# EAGLE schematic train cont R4 (EAGLE 8.1.1)
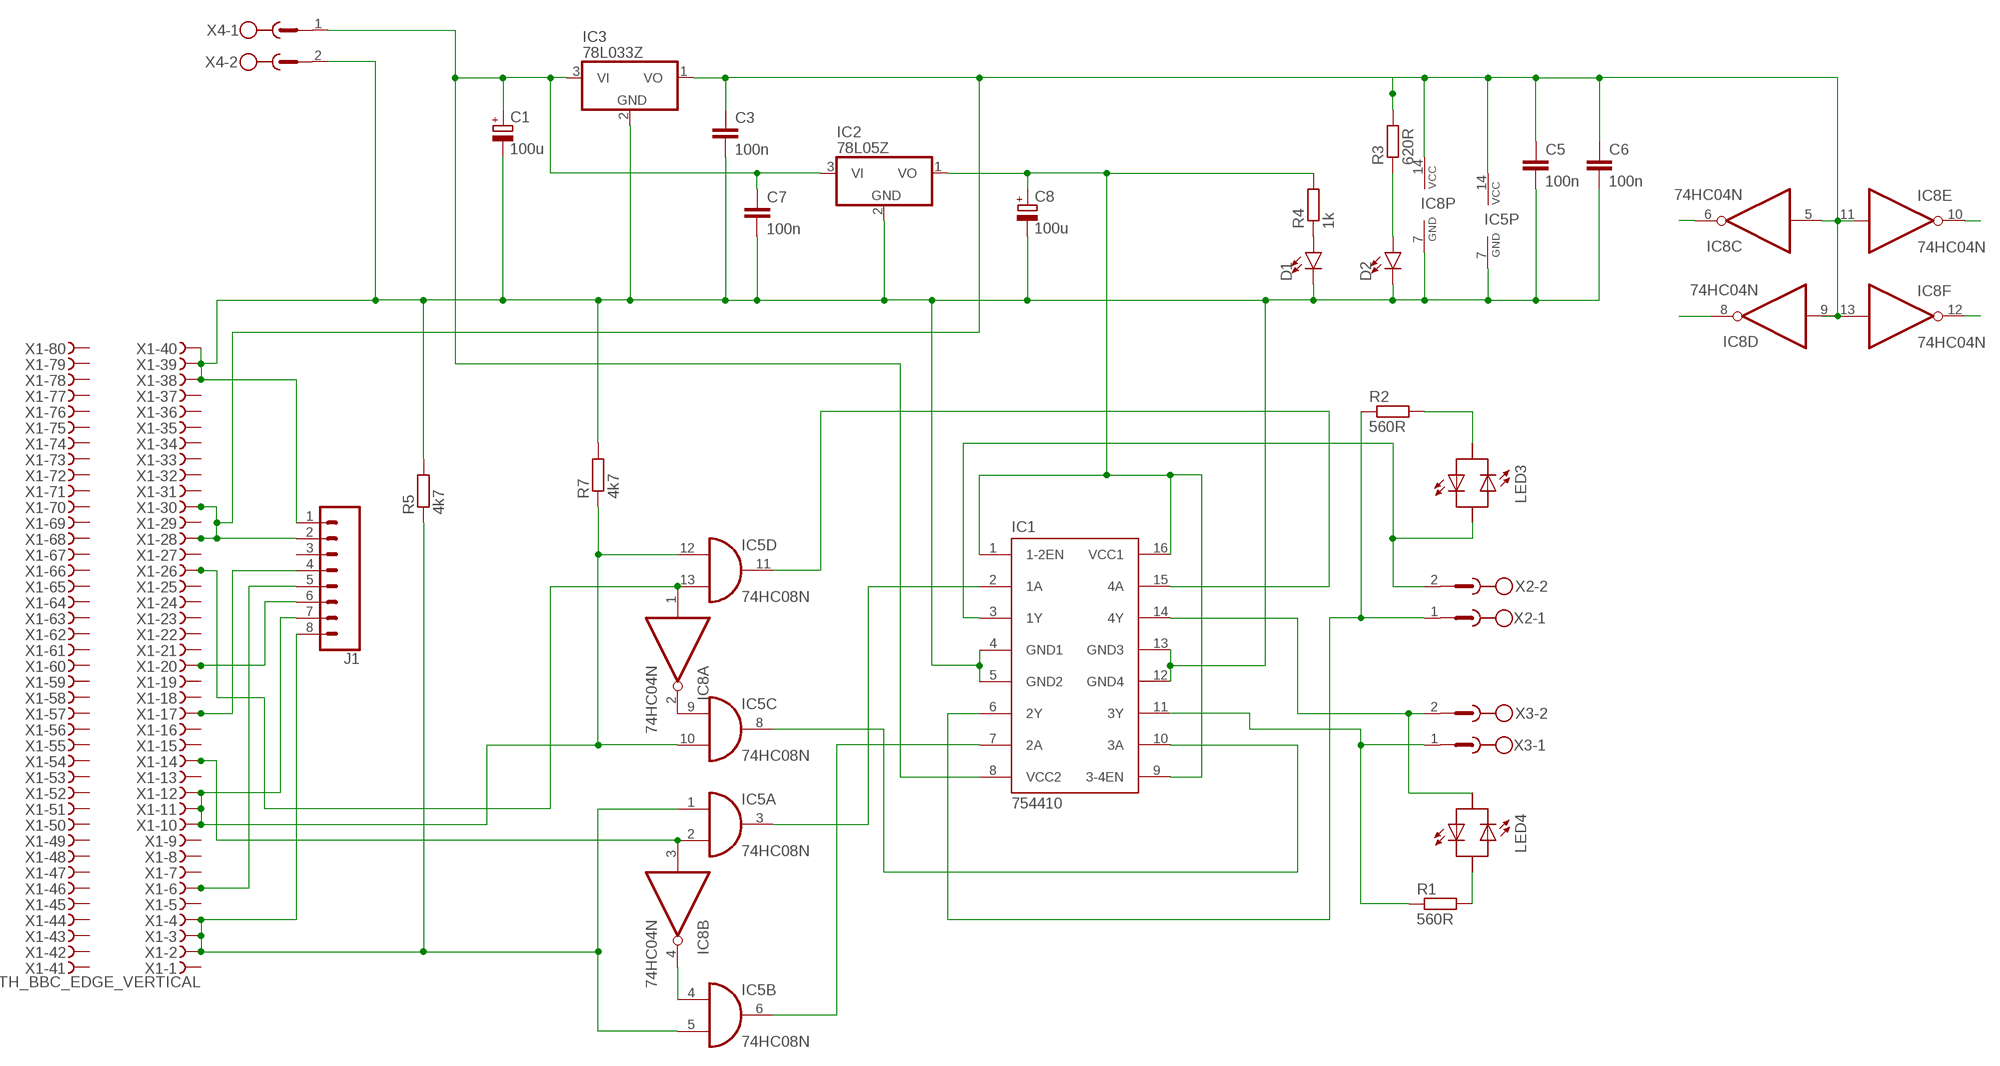
[diagram p0: schematic, sheet 1]

## Parts
C1  100u  CPOL-EUE2,5-6E  [E2,5-6E]
C3  100n  C-EU050-025X075  [C050-025X075]
C5  100n  C-EU050-025X075  [C050-025X075]
C6  100n  C-EU050-025X075  [C050-025X075]
C7  100n  C-EU050-025X075  [C050-025X075]
C8  100u  CPOL-EUE2,5-6E  [E2,5-6E]
D1  LED3MM  [LED_3MM]
D2  LED3MM  [LED_3MM]
IC1  754410  L293E  [DIL16]
IC2  78L05Z  [TO92]
IC3  78L033Z  78L05Z  [TO92]
IC5  74HC08N  [DIL14]
IC8  74HC04N  74AC04N  [DIL14]
J1  CONN_08"  [1X08]
LED3  LED_LED5MM  [LED_LED5MM]
LED4  LED_LED5MM  [LED_LED5MM]
R1  560R  R-EU_0207/10  [0207/10]
R2  560R  R-EU_0207/10  [0207/10]
R3  620R  R-EU_0207/10  [0207/10]
R4  1k  R-EU_0207/10  [0207/10]
R5  4k7  R-EU_0207/15  [0207/15]
R7  4k7  R-EU_0207/10  [0207/10]
X1  PTH_BBC_EDGE_VERTICAL  [PTH_BBC_EDGE]
X2  MSTBV2  [MSTBV2]
X3  MSTBV2  [MSTBV2]
X4  MSTBV2  [MSTBV2]

## Nets
N$1: LED4.K(C) R1.2
N$2: C3.1 C5.1 C6.1 IC3.1(VO) IC5.14(P:VCC) IC8.5(C:I) IC8.9(D:I) IC8.11(E:I) IC8.13(F:I) IC8.14(P:VCC) J1.2 R3.2 X1.28 X1.30
N$3: IC5.4(B:I0) IC8.4(B:O)
N$4: D2.A R3.1
N$5: IC1.2(1A) IC5.3(A:O)
N$6: IC8.12(F:O)
N$7: C8.+ IC1.1(1-2EN) IC1.9(3-4EN) IC1.16(VCC1) IC2.1(VO) R4.2
N$8: C1.+ C7.1 IC1.8(VCC2) IC2.3(VI) IC3.3(VI) X4.1
N$9: IC5.9(C:I0) IC8.2(A:O)
N$10: IC1.7(2A) IC5.6(B:O)
N$12: IC5.1(A:I0) IC5.5(B:I1) J1.8 R5.1 X1.2 X1.3 X1.4
N$13: IC5.2(A:I1) IC8.3(B:I) X1.14
N$14: IC1.15(4A) IC5.11(D:O)
N$15: IC1.10(3A) IC5.8(C:O)
N$16: IC1.3(1Y) LED3.K(C) X2.2
N$17: IC1.6(2Y) R2.1 X2.1
N$18: IC1.14(4Y) LED4.A X3.2
N$19: IC1.11(3Y) R1.1 X3.1
N$21: LED3.A R2.2
N$22: D1.A R4.1
N$23: C1.- C3.2 C5.2 C6.2 C7.2 C8.- D1.K(C) D2.K(C) IC1.4(GND1) IC1.5(GND2) IC1.12(GND4) IC1.13(GND3) IC2.2(GND) IC3.2(GND) IC5.7(P:GND) IC8.7(P:GND) J1.1 R5.2 R7.2 X1.38 X1.39 X1.40 X4.2
N$25: IC8.8(D:O)
N$26: IC8.10(E:O)
N$27: IC8.6(C:O)
N$28: IC5.10(C:I1) IC5.12(D:I0) J1.7 R7.1 X1.10 X1.11 X1.12
N$29: J1.6 X1.20
N$31: J1.5 X1.6
N$32: J1.4 X1.17
N$37: IC5.13(D:I1) IC8.1(A:I) X1.26
Unconnected: J1.3 X1.1 X1.5 X1.7 X1.8 X1.9 X1.13 X1.15 X1.16 X1.18 X1.19 X1.21 X1.22 X1.23 X1.24 X1.25 X1.27 X1.29 X1.31 X1.32 X1.33 X1.34 X1.35 X1.36 X1.37 X1.41 X1.42 X1.43 X1.44 X1.45 X1.46 X1.47 X1.48 X1.49 X1.50 X1.51 X1.52 X1.53 X1.54 X1.55 X1.56 X1.57 X1.58 X1.59 X1.60 X1.61 X1.62 X1.63 X1.64 X1.65 X1.66 X1.67 X1.68 X1.69 X1.70 X1.71 X1.72 X1.73 X1.74 X1.75 X1.76 X1.77 X1.78 X1.79 X1.80

## Library data of the parts
C1 C8 = resistor:CPOL-EU: POLARIZED CAPACITOR, European symbol
C3 C5-C7 = resistor:C-EU: CAPACITOR, European symbol
D1 D2 = SparkFun-LED:LED: LED (Generic) Standard schematic elements and footprints for 5mm, 3mm, 1206, and 0603 sized LEDs. Generic LEDs with no color specified.; PROD_ID: DIO-08794
IC1 = texas:L293E: TI DEVICE; MF: Arrow Electronics; MPN: L293E; OC_FARNELL: 1467711; OC_NEWARK: 89K0732
IC2 IC3 = linear:78*: Positive VOLTAGE REGULATOR Source: http://cache.national.com/ds/LM/LM78L05.pdf http://www.fairchildsemi.com/ds/LM/LM7805.pdf
IC5 = 74xx-eu:74*08: Quad 2-input AND gate
IC8 = 74xx-eu:74*04: Hex INVERTER
J1 = SparkFun-Connectors:CONN_08: Multi connection point. Often used as Generic Header-pin footprint for 0.1 inch spaced/style header connections On any of the 0.1 inch spaced packages, you can populate with these: Break Away Headers - Straight <https://www.sparkfun.com/products/116> (PRT-00116) Break Away Male Headers - Right Angle <https://www.sparkfun.com/products/553> (PRT-00553) Female Headers <https://www.sparkfun.com/products/115> (PRT-00115) Break Away Headers - Machine Pin <https://www.sparkfun.com/products/117> (PRT-00117) Break Away Female Headers - Swiss Machine Pin <https://www.sparkfun.com/products/743> (PRT-00743) Arduino Stackable Header - 8 Pin <https://www.sparkfun.com/products/9279> (PRT-09279) For SCREWTERMINALS and SPRING TERMINALS visit here: Screw Terimnals on SparkFun.com <https://www.sparkfun.com/search/results?term=Screw+Terminals> (5mm/3.5mm/2.54mm spacing) This device is also useful as a general connection point to wire up your design to another part of your project. Our various solder wires solder well into these plated through hole pads. Hook-Up Wire - Assortment (Stranded, 22 AWG) <https://www.sparkfun.com/products/11375> (PRT-11375) Hook-Up Wire - Assortment (Solid Core, 22 AWG) <https://www.sparkfun.com/products/11367> (PRT-11367) View the entire wire category on our website here <https://www.sparkfun.com/categories/141> Special notes: Molex polarized connector foot print use with SKU : PRT-08231 with associated crimp pins and housings. 1MM SMD Version SKU: PRT-10208 NOTES ON THE VARIANTS LOCK and LOCK_LONGPADS... This footprint was designed to help hold the alignment of a through-hole component (i.e. 6-pin header) while soldering it into place. You may notice that each hole has been shifted either up or down by 0.005 of an inch from it's more standard position (which is a perfectly straight line). This slight alteration caused the pins (the squares in the middle) to touch the edges of the holes. Because they are alternating, it causes a "brace" to hold the component in place. 0.005 has proven to be the perfect amount of "off-center" position when using our standard breakaway headers. Although looks a little odd when you look at the bare footprint, once you have a header in there, the alteration is very hard to notice. Also,if you push a header all the way into place, it is covered up entirely on the bottom side.; PROD_ID: CONN-08438
LED3 LED4 = traintrain cont R2a:LED_LED: LED OSRAM: - CHIPLED LG R971, LG N971, LY N971, LG Q971, LY Q971, LO R971, LY R971 LH N974, LH R974 LS Q976, LO Q976, LY Q976 LO Q996 - Hyper CHIPLED LW Q18S LB Q993, LB Q99A, LB R99A - SideLED LS A670, LO A670, LY A670, LG A670, LP A670 LB A673, LV A673, LT A673, LW A673 LH A674 LY A675 LS A676, LA A676, LO A676, LY A676, LW A676 LS A679, LY A679, LG A679 - Hyper Micro SIDELED® LS Y876, LA Y876, LO Y876, LY Y876 LT Y87S - SmartLED LW L88C, LW L88S LB L89C, LB L89S, LG L890 LS L89K, LO L89K, LY L89K LS L896, LA L896, LO L896, LY L896 - TOPLED LS T670, LO T670, LY T670, LG T670, LP T670 LSG T670, LSP T670, LSY T670, LOP T670, LYG T670 LG T671, LOG T671, LSG T671 LB T673, LV T673, LT T673, LW T673 LH T674 LS T676, LA T676, LO T676, LY T676, LB T676, LH T676, LSB T676, LW T676 LB T67C, LV T67C, LT T67C, LS T67K, LO T67K, LY T67K, LW E67C LS E67B, LA E67B, LO E67B, LY E67B, LB E67C, LV E67C, LT E67C LW T67C LS T679, LY T679, LG T679 LS T770, LO T770, LY T770, LG T770, LP T770 LB T773, LV T773, LT T773, LW T773 LH T774 LS E675, LA E675, LY E675, LS T675 LS T776, LA T776, LO T776, LY T776, LB T776 LHGB T686 LT T68C, LB T68C - Hyper Mini TOPLED® LB M676 - Mini TOPLED Santana® LG M470 LS M47K, LO M47K, LY M47K Source: http://www.osram.convergy.de LUXEON: - LUMILED® LXK2-PW12-R00, LXK2-PW12-S00, LXK2-PW14-U00, LXK2-PW14-V00 LXK2-PM12-R00, LXK2-PM12-S00, LXK2-PM14-U00 LXK2-PE12-Q00, LXK2-PE12-R00, LXK2-PE12-S00, LXK2-PE14-T00, LXK2-PE14-U00 LXK2-PB12-K00, LXK2-PB12-L00, LXK2-PB12-M00, LXK2-PB14-N00, LXK2-PB14-P00, LXK2-PB14-Q00 LXK2-PR12-L00, LXK2-PR12-M00, LXK2-PR14-Q00, LXK2-PR14-R00 LXK2-PD12-Q00, LXK2-PD12-R00, LXK2-PD12-S00 LXK2-PH12-R00, LXK2-PH12-S00 LXK2-PL12-P00, LXK2-PL12-Q00, LXK2-PL12-R00 Source: www.luxeon.com KINGBRIGHT: KA-3528ASYC Source: www.kingbright.com
R1-R5 R7 = resistor:R-EU_: RESISTOR, European symbol
X1 = microbit:PTH_BBC_EDGE_VERTICAL: TE CONNECTIVITY / AMP - BUCHSE, SCSI, VERTIKAL, 80 Source: Data sheet <http://www.tycoelectronics.com/commerce/DocumentDelivery/DDEController?Action=srchrtrv&DocNm=5749069&DocType=Customer+Drawing&DocLang=English>
X2-X4 = con-phoenix-500:MSTBV2: PHOENIX; OC_FARNELL: unknown; OC_NEWARK: unknown